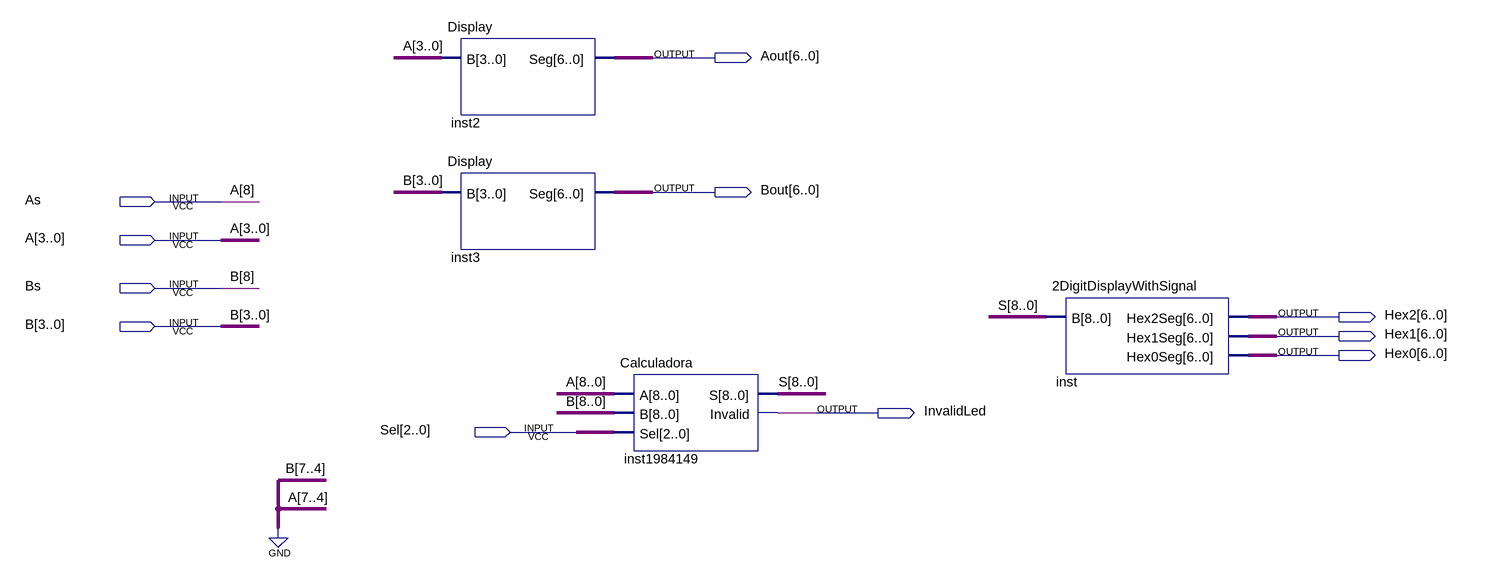
[diagram p0: schematic sheet]
// Quartus schematic Main.bdf as structural Verilog: 4 symbols, 11 pins
module Main (
  input  As,
  input  [7:0] A,
  input  Bs,
  input  [3:0] B,
  input  [2:0] Sel,
  output [6:0] Aout,
  output [6:0] Bout,
  output [6:0] Hex2,
  output [6:0] Hex1,
  output [6:0] Hex0,
  output InvalidLed
);

  wire [8:0] S;

  Display inst2 (.B(A[3:0]), .Seg(Aout));
  Display inst3 (.B(B), .Seg(Bout));
  Calculadora inst1984149 (.A({As, A}), .B({Bs, 4'b0000, B}), .Sel(Sel), .S(S), .Invalid(InvalidLed));
  \2DigitDisplayWithSignal  inst (.B(S), .Hex2Seg(Hex2), .Hex1Seg(Hex1), .Hex0Seg(Hex0));

  // Other names for the same wires on the sheet: A[8] = As; B[8] = Bs
endmodule
